# Altium schematic sheet LCR_0.SchDoc
size 316 x 277 mm; Organization: Altium Limited; Address1: L3, 12a Rodborough Rd; Address2: Frenchs Forest; Address3: NSW; Address4: Australia 2086; Origin: Eagle
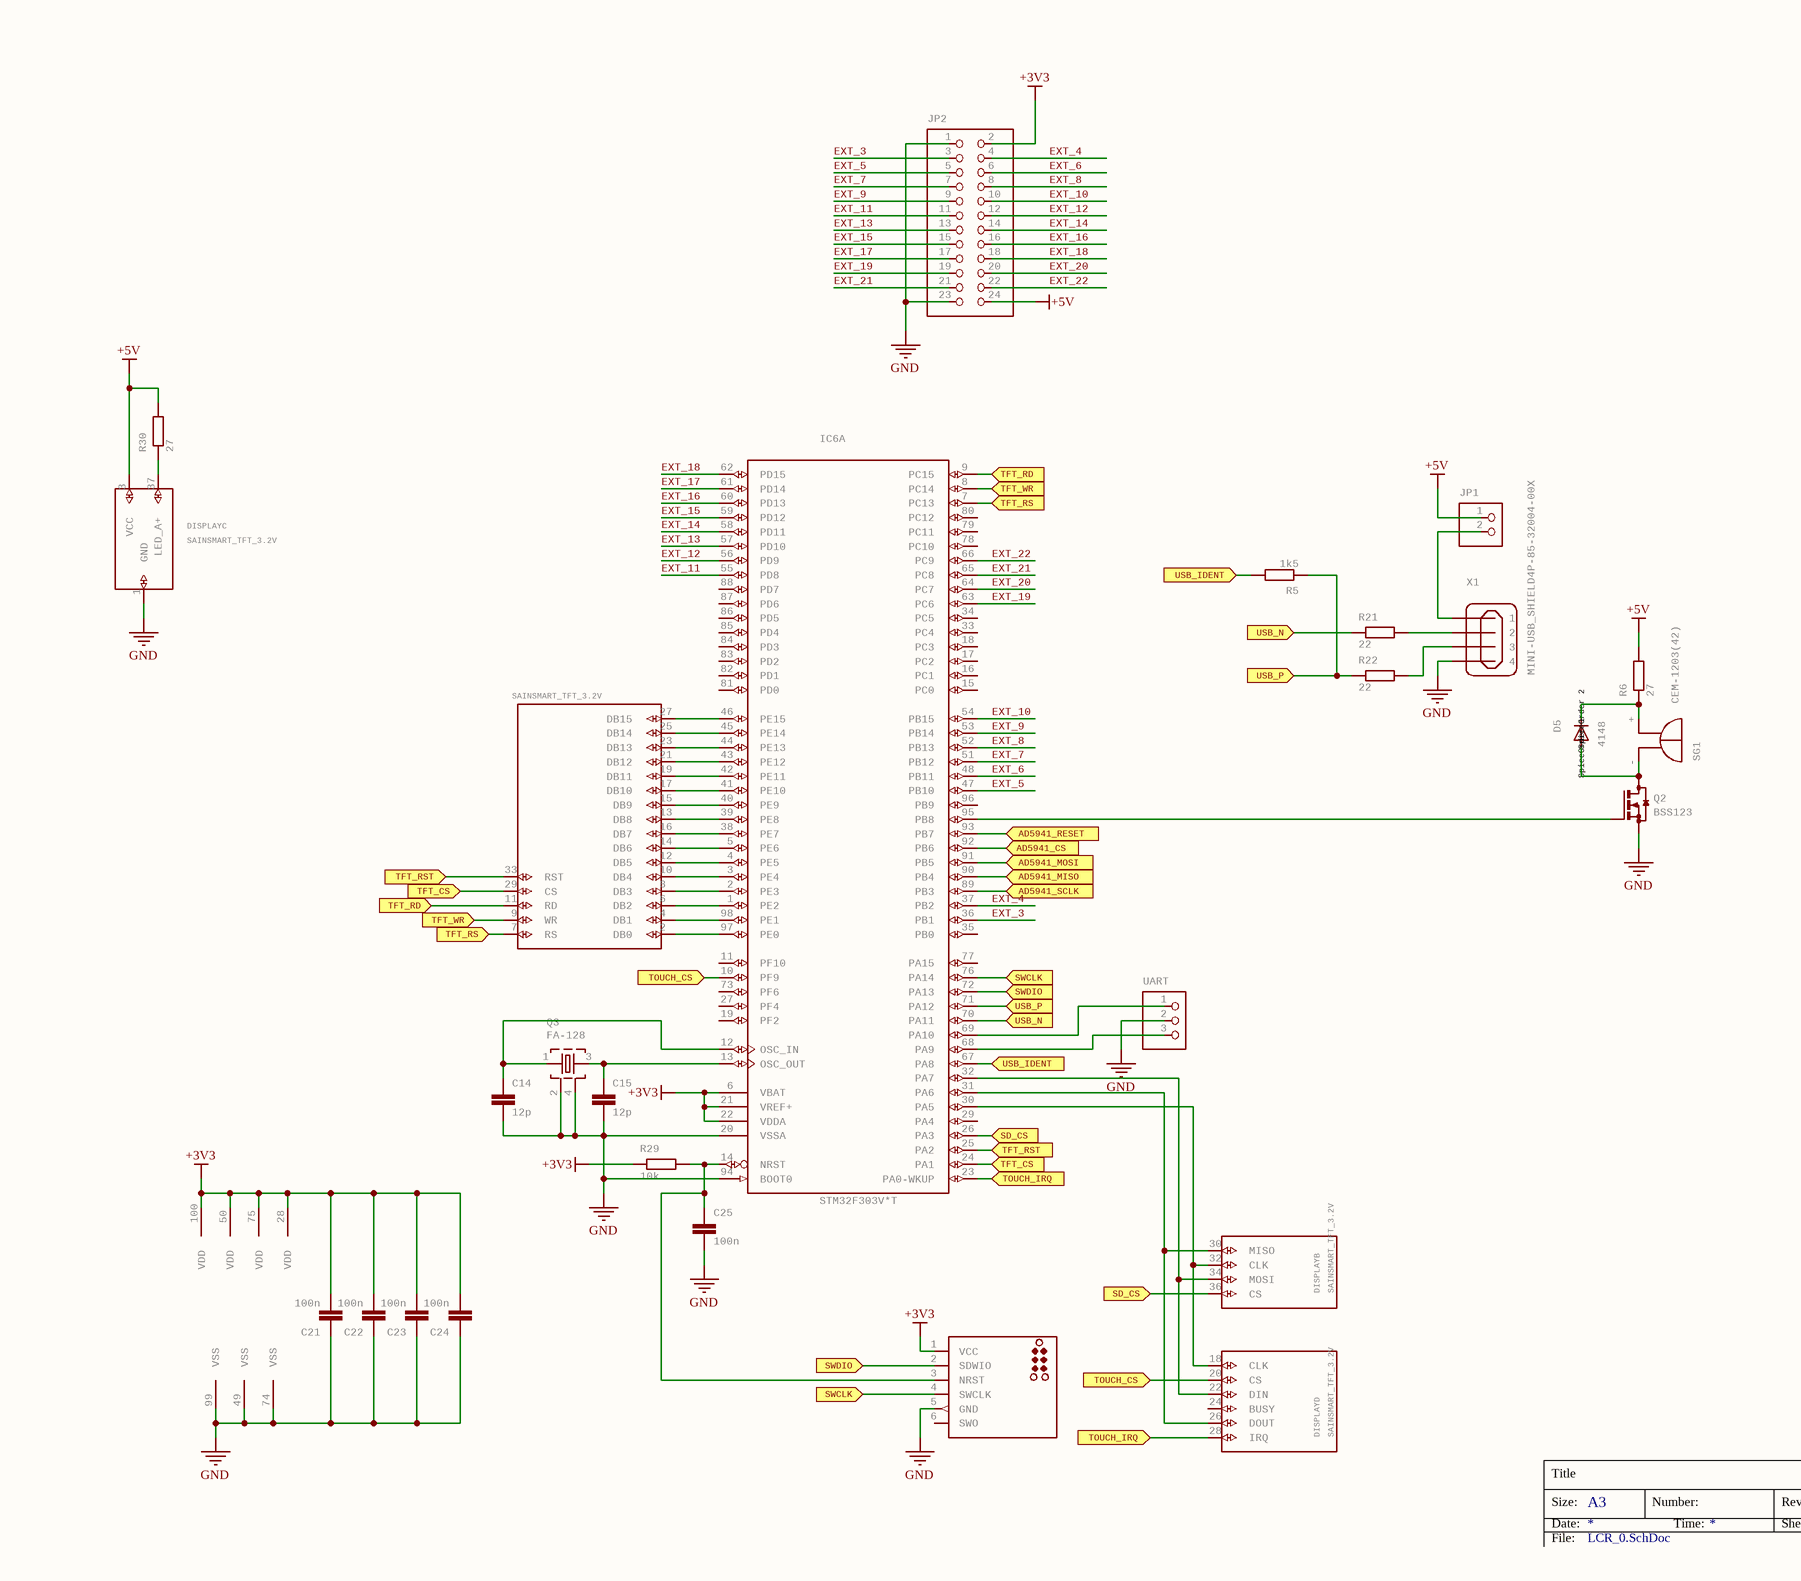
[diagram p0: LCR_0.SchDoc]

## Parts
C14  value 12p  [C0603K]
C15  value 12p  [C0603K]
C21  value 100n  [C0603K]
C22  value 100n  [C0603K]
C23  value 100n  [C0603K]
C24  value 100n  [C0603K]
C25  value 100n  [C0603K]
D5  value 4148  SpiceOrder1: SpiceOrder 1  SpiceOrder2: SpiceOrder 2  [SOD123]
DISPLAY  SAINSMART_TFT_3.2V  [SAINSMART_ANGLED]  (parts A,B,C,D of 4)
IC6  STM32F303V*T  [LQFP100]  (parts A,B of 2)
J1  TC2030-MCP  [TC2030-MCP]  (value not drawn)
JP1  (no value)  [1X02]
JP2  (no value)  [2X12]
Q2  BSS123  [SOT23]
Q3  FA-128  [FA-128]
R5  value 1k5  [R0603]
R6  value 27  [R1206]
R21  value 22  [R0603]
R22  value 22  [R0603]
R29  value 10k  [R0603]
R30  value 27  [R1206]
SG1  CEM-1203(42)  [F/QMBIII]
UART  (no value)  [1X03]
X1  MINI-USB_SHIELD4P-85-32004-00X  [85-32004-00X]

## Ports
AD5941_CS (in), AD5941_MISO (in), AD5941_MOSI (in), AD5941_RESET (in), AD5941_SCLK (in), SD_CS (in), SWCLK (in), SWDIO (in), TFT_CS (in), TFT_RD (in), TFT_RS (in), TFT_RST (in), TFT_WR (in), TOUCH_CS (in), TOUCH_IRQ (in), USB_IDENT (in), USB_N (in), USB_P (in)

## Nets
+3V3: C21.2 C22.2 C23.2 C24.2 IC6.6(VBAT) IC6.21(VREF+) IC6.22(VDDA) IC6.28(VDD) IC6.50(VDD) IC6.75(VDD) IC6.100(VDD) J1.1(VCC) JP2.2 R29.1
+5V: DISPLAY.3(VCC) JP1.1 JP2.24 R6.2 R30.2
GND: C14.2 C15.2 C21.1 C22.1 C23.1 C24.1 C25.2 DISPLAY.1(GND) IC6.20(VSSA) IC6.49(VSS) IC6.74(VSS) IC6.94(BOOT0) IC6.99(VSS) J1.5(GND) JP2.1 JP2.23 Q2.2(S) Q3.2 Q3.4 UART.2 X1.4
AD5941_CS: IC6.92(PB6) ; port AD5941_CS
AD5941_MISO: IC6.90(PB4) ; port AD5941_MISO
AD5941_MOSI: IC6.91(PB5) ; port AD5941_MOSI
AD5941_RESET: IC6.93(PB7) ; port AD5941_RESET
AD5941_SCLK: IC6.89(PB3) ; port AD5941_SCLK
EXT_3: IC6.36(PB1) JP2.3
EXT_4: IC6.37(PB2) JP2.4
EXT_5: IC6.47(PB10) JP2.5
EXT_6: IC6.48(PB11) JP2.6
EXT_7: IC6.51(PB12) JP2.7
EXT_8: IC6.52(PB13) JP2.8
EXT_9: IC6.53(PB14) JP2.9
EXT_10: IC6.54(PB15) JP2.10
EXT_11: IC6.55(PD8) JP2.11
EXT_12: IC6.56(PD9) JP2.12
EXT_13: IC6.57(PD10) JP2.13
EXT_14: IC6.58(PD11) JP2.14
EXT_15: IC6.59(PD12) JP2.15
EXT_16: IC6.60(PD13) JP2.16
EXT_17: IC6.61(PD14) JP2.17
EXT_18: IC6.62(PD15) JP2.18
EXT_19: IC6.63(PC6) JP2.19
EXT_20: IC6.64(PC7) JP2.20
EXT_21: IC6.65(PC8) JP2.21
EXT_22: IC6.66(PC9) JP2.22
SD_CS: DISPLAY.36(CS) IC6.26(PA3) ; port SD_CS
SWCLK: IC6.76(PA14) J1.4(SWCLK) ; port SWCLK
SWDIO: IC6.72(PA13) J1.2(SDWIO) ; port SWDIO
TFT_CS: DISPLAY.29(CS) IC6.24(PA1) ; port TFT_CS
TFT_RD: DISPLAY.11(RD) IC6.9(PC15) ; port TFT_RD
TFT_RS: DISPLAY.7(RS) IC6.7(PC13) ; port TFT_RS
TFT_RST: DISPLAY.33(RST) IC6.25(PA2) ; port TFT_RST
TFT_WR: DISPLAY.9(WR) IC6.8(PC14) ; port TFT_WR
TOUCH_CS: DISPLAY.20(CS) IC6.10(PF9) ; port TOUCH_CS
TOUCH_IRQ: DISPLAY.28(IRQ) IC6.23(PA0-WKUP) ; port TOUCH_IRQ
USB_IDENT: IC6.67(PA8) R5.2 ; port USB_IDENT
USB_N: IC6.70(PA11) R21.1 ; port USB_N
USB_P: IC6.71(PA12) R5.1 R22.1 ; port USB_P
NetC14_1: C14.1 IC6.12(OSC_IN) Q3.1
NetC15_1: C15.1 IC6.13(OSC_OUT) Q3.3
NetC25_1: C25.1 IC6.14(NRST) J1.3(NRST) R29.2
NetD5_A: D5.A Q2.3(D) SG1.-(+)
NetD5_C: D5.C R6.1 SG1.+(-)
NetDISPLAY_2: DISPLAY.2(DB0) IC6.97(PE0)
NetDISPLAY_4: DISPLAY.4(DB1) IC6.98(PE1)
NetDISPLAY_6: DISPLAY.6(DB2) IC6.1(PE2)
NetDISPLAY_8: DISPLAY.8(DB3) IC6.2(PE3)
NetDISPLAY_10: DISPLAY.10(DB4) IC6.3(PE4)
NetDISPLAY_12: DISPLAY.12(DB5) IC6.4(PE5)
NetDISPLAY_13: DISPLAY.13(DB8) IC6.39(PE8)
NetDISPLAY_14: DISPLAY.14(DB6) IC6.5(PE6)
NetDISPLAY_15: DISPLAY.15(DB9) IC6.40(PE9)
NetDISPLAY_16: DISPLAY.16(DB7) IC6.38(PE7)
NetDISPLAY_17: DISPLAY.17(DB10) IC6.41(PE10)
NetDISPLAY_18: DISPLAY.18(CLK) DISPLAY.32(CLK) IC6.30(PA5)
NetDISPLAY_19: DISPLAY.19(DB11) IC6.42(PE11)
NetDISPLAY_21: DISPLAY.21(DB12) IC6.43(PE12)
NetDISPLAY_22: DISPLAY.22(DIN) DISPLAY.34(MOSI) IC6.32(PA7)
NetDISPLAY_23: DISPLAY.23(DB13) IC6.44(PE13)
NetDISPLAY_25: DISPLAY.25(DB14) IC6.45(PE14)
NetDISPLAY_26: DISPLAY.26(DOUT) DISPLAY.30(MISO) IC6.31(PA6)
NetDISPLAY_27: DISPLAY.27(DB15) IC6.46(PE15)
NetDISPLAY_37: DISPLAY.37(LED_A+) R30.1
NetIC6_68: IC6.68(PA9) UART.3
NetIC6_69: IC6.69(PA10) UART.1
NetIC6_95: IC6.95(PB8) Q2.1(G)
NetJP1_2: JP1.2 X1.1
NetR21_2: R21.2 X1.2
NetR22_2: R22.2 X1.3

Not connected (* = marked no-connect by the designer): DISPLAY 24(BUSY); IC6 11(PF10) 15(PC0) 16(PC1) 17(PC2) 18(PC3) 19(PF2) 27(PF4) 29(PA4) 33(PC4) 34(PC5) 35(PB0) 73(PF6) 77(PA15) 78(PC10) 79(PC11) 80(PC12) 81(PD0) 82(PD1) 83(PD2) 84(PD3) 85(PD4) 86(PD5) 87(PD6) 88(PD7) 96(PB9); J1 6(SWO)

## Notes on the sheet
- Title
- Size:
- Date:
- A3
- Number:
- Time:
- Revision:
- Sheet
- of
- RayaBonyanLotus
- File:

## Library data of the parts
C14 C15 C21-C25 = C-EUC0603K: CAPACITOR, European symbol; GateName_1: G$1; SymbolName_1: C-EU; DeviceName: C0603K; LibraryName: rcl; DeviceSetName: C-EU
D5 = DIODE-SOD123: DIODE; GateName_1: G$1; SymbolName_1: D; DeviceSetName: DIODE-; DeviceName: SOD123; LibraryName: diode
DISPLAY = SAINSMART_TFT_3.2V: GateName_1: SSD1289; SymbolName_1: LCDCONTROLLER; GateName_2: SD-CARD; SymbolName_2: LCDSD; GateName_3: SUPPLY; SymbolName_3: LCDSUPPLY; GateName_4: ADS7843; SymbolName_4: LCDTOUCH; DeviceName: V; LibraryName: sainsmart; DeviceSetName: SAINSMART_TFT_3.2
IC6 = STM32F303V*T: ARM 32-bit Cortexâ„¢-M3 CPU   72 MHz maximum frequency 128 to 256 Kbytes of Flash memory 32 to 40 kbytes of SRAM 87 GPIOs 2.0 to 3.6 V application supply; GateName_1: MCU; SymbolName_1: STM32_100PIN_TYP3; GateName_2: PWR; SymbolName_2: PWR_VDD4_VSS3; LibraryName: micro-stm_v3; DeviceSetName: STM32F303V*T
J1 = TC2030-MCP: TAG-CONNECT ICSP Connector  Manufacturer: Tag-Connect  Cable for easy In-Circuit Serial Programming. Designed for Microchip ICD2, suitable for many others. Two variants - one "with legs" (for hands-free fit on PCB) and another "without legs" for quick programming.       	   PAD	Description	   1	MCLR/Vpp	   2	Vdd	   3	GND	   4	PGD (ISPDAT)	   5	PGC (ISPCLK)	   6	nc (used for LVP)		  آ©2009 ROFA.cz - modified and updated by Robert Darlington ‹rdarlington@gmail.com›; GateName_1: G$1; DeviceName: -MCP; DeviceSetName: TC2030; SymbolName_1: ICSP; LibraryName: tag-connect
JP1 = PINHD-1X2: PIN HEADER; GateName_1: G$1; SymbolName_1: PINHD2; LibraryName: pinhead; DeviceSetName: PINHD-1X2; VALUE: PINHD-1X2
JP2 = PINHD-2X12: PIN HEADER; GateName_1: A; SymbolName_1: PINH2X12; LibraryName: pinhead; DeviceSetName: PINHD-2X12; VALUE: PINHD-2X12
Q2 = BSS123: N-CHANNEL MOS FET; GateName_1: G$1; SymbolName_1: N-MOS; LibraryName: transistor-small-signal; DeviceSetName: BSS123
Q3 = FA-128: MHz RANGE CRYSTAL UNIT    Source: Epson Toyocom; GateName_1: G$1; SymbolName_1: Q-SHIELD2; DeviceName: 128; DeviceSetName: FA-; LibraryName: crystal
R5 R21 R22 R29 = R-EU_R0603: RESISTOR, European symbol; GateName_1: G$1; SymbolName_1: R-EU-1; DeviceSetName: R-EU_; DeviceName: R0603; LibraryName: resistor
R6 R30 = R-EU_R1206: RESISTOR, European symbol; GateName_1: G$1; SymbolName_1: R-EU-1; DeviceSetName: R-EU_; DeviceName: R1206; LibraryName: resistor
SG1 = F/QMBIII: BUZZER    Source: Buerklin; GateName_1: G$1; SymbolName_1: B; LibraryName: buzzer; DeviceSetName: F/QMBIII; MF: MF; MPN: MPN; OC_FARNELL: unknown; OC_NEWARK: unknown
UART = PINHD-1X3: PIN HEADER; GateName_1: A; SymbolName_1: PINHD3; LibraryName: pinhead; DeviceSetName: PINHD-1X3; VALUE: PINHD-1X3
X1 = MINI-USB_SHIELD4P-85-32004-00X: MINI USB 4 Pol.   Source: www.cypressindustries.com; GateName_1: G$1; SymbolName_1: MINI-USB-4P-; DeviceName: 85-32004-00X; LibraryName: con-cypressindustries; DeviceSetName: MINI-USB_SHIELD4P-; MF: MF; MPN: MPN; OC_FARNELL: unknown; OC_NEWARK: unknown